# EAGLE design Digispark_clone (EAGLE 6.5.0)
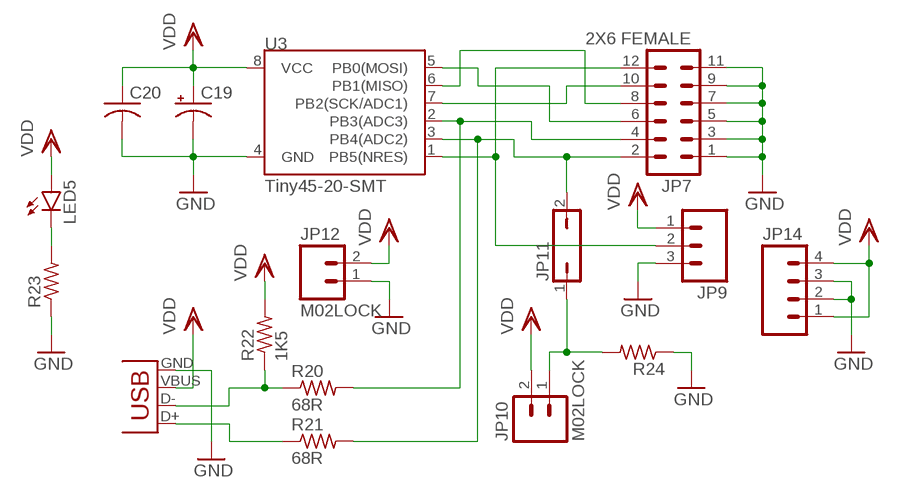
[diagram p0: schematic, sheet 1]

## Parts
C19  CPOL-USE2-5  [E2-5]
C20  C-USC0805  [C0805]
JP7  2X6 FEMALE  M06X2PTH_FEMALE  [2X6]
JP8  USB-SMD-NS  [USB-MINIB-NOSTOP]
JP9  M03LOCK  [1X03_LOCK]
JP10  M02LOCK  [1X02_LOCK]
JP11  JP1Q  [JP1]
JP12  M02LOCK  [1X02_LOCK]
JP14  M04LOCK  [1X04_LOCK]
LED5  LED1206  [LED-1206]
R20  68R  R-US_R0805  [R0805]
R21  68R  R-US_R0805  [R0805]
R22  1K5  R-US_R0805  [R0805]
R23  R-US_R0805  [R0805]
R24  R-US_R0805  [R0805]
U3  Tiny45-20-SMT  ATTINY45TINY45-20-SMT  [SO08-EIAJ]

## Nets
D+: JP7.2 JP11.2 R21.2 U3.3(PB4(ADC2))
D-: JP7.4 R20.2 U3.2(PB3(ADC3))
GND: C19.- C20.2 JP7.1 JP7.3 JP7.5 JP7.7 JP7.9 JP7.11 JP8.GND JP9.3 JP12.1 JP14.2 JP14.3 R23.1 R24.1 U3.4(GND)
N$27: JP7.12 JP9.2 U3.1(PB5(NRES))
N$28: JP7.6 U3.5(PB0(MOSI))
N$29: JP7.10 U3.7(PB2(SCK/ADC1))
N$30: JP10.1 JP11.1 R24.2
N$32: JP7.8 U3.6(PB1(MISO))
N$33: LED5.C R23.2
N$34: JP8.D- R20.1 R22.1
N$35: JP8.D+ R21.1
VDD: C19.+ C20.1 JP8.VBUS JP9.1 JP10.2 JP12.2 JP14.1 JP14.4 LED5.A R22.2 U3.8(VCC)

## Library data of the parts
C19 = rcl:CPOL-US: POLARIZED CAPACITOR, American symbol
C20 = rcl:C-US: CAPACITOR, American symbol
JP7 = SparkFun-Connectors:M06X2; PROD_ID: CONN-12423
JP8 = SparkFun-Connectors:USB: USB Connectors USB-B-PTH is fully proven SKU : PRT-00139/CONN-08278 USB-miniB is fully proven SKU : PRT-00587 USB-A-PCB is untested. USB-A-H is throughly reviewed, but untested. Spark Fun Electronics SKU : PRT-00437 USB-B-SMT is throughly reviewed, but untested. Needs silkscreen touching up. USB-A-S has not been used/tested USB-MB-H has not been used/tested USB-MICROB has been used. CONN-09505
JP9 = SparkFun-Connectors:M03: Header 3 Standard 3-pin 0.1" header. Use with straight break away headers (SKU : PRT-00116), right angle break away headers (PRT-00553), swiss pins (PRT-00743), machine pins (PRT-00117), and female headers (PRT-00115). Molex polarized connector foot print use with SKU : PRT-08232 with associated crimp pins and housings.
JP10 JP12 = SparkFun-Connectors:M02: Standard 2-pin 0.1" header. Use with - straight break away headers ( PRT-00116) - right angle break away headers (PRT-00553) - swiss pins (PRT-00743) - machine pins (PRT-00117) - female headers (PRT-00115) Molex polarized connector foot print use with: PRT-08233 with associated crimp pins and housings. 2.54_SCREWTERM for use with PRT-10571. 3.5mm Screw Terminal footprints for PRT-08084 5mm Screw Terminal footprints for use with PRT-08432
JP11 = jumper:JP1Q: JUMPER
JP14 = SparkFun-Connectors:M04: Header 4 Standard 4-pin 0.1" header. Use with straight break away headers (SKU : PRT-00116), right angle break away headers (PRT-00553), swiss pins (PRT-00743), machine pins (PRT-00117), and female headers (PRT-00115). Molex polarized connector foot print use with SKU : PRT-08231 with associated crimp pins and housings. 1MM SMD Version SKU: PRT-10208
LED5 = SparkFun-LED:LED: LEDs Standard schematic elements and footprints for 5mm, 3mm, 1206, and 0603 sized LEDs. 5mm - Spark Fun Electronics SKU : COM-00529 (and others)
R20-R24 = rcl:R-US_: RESISTOR, American symbol
U3 = SparkFun-DigitalIC:ATTINY45: Atmel 8-pin 2/4/8kB flash uC; PROD_ID: IC-08922

## Board
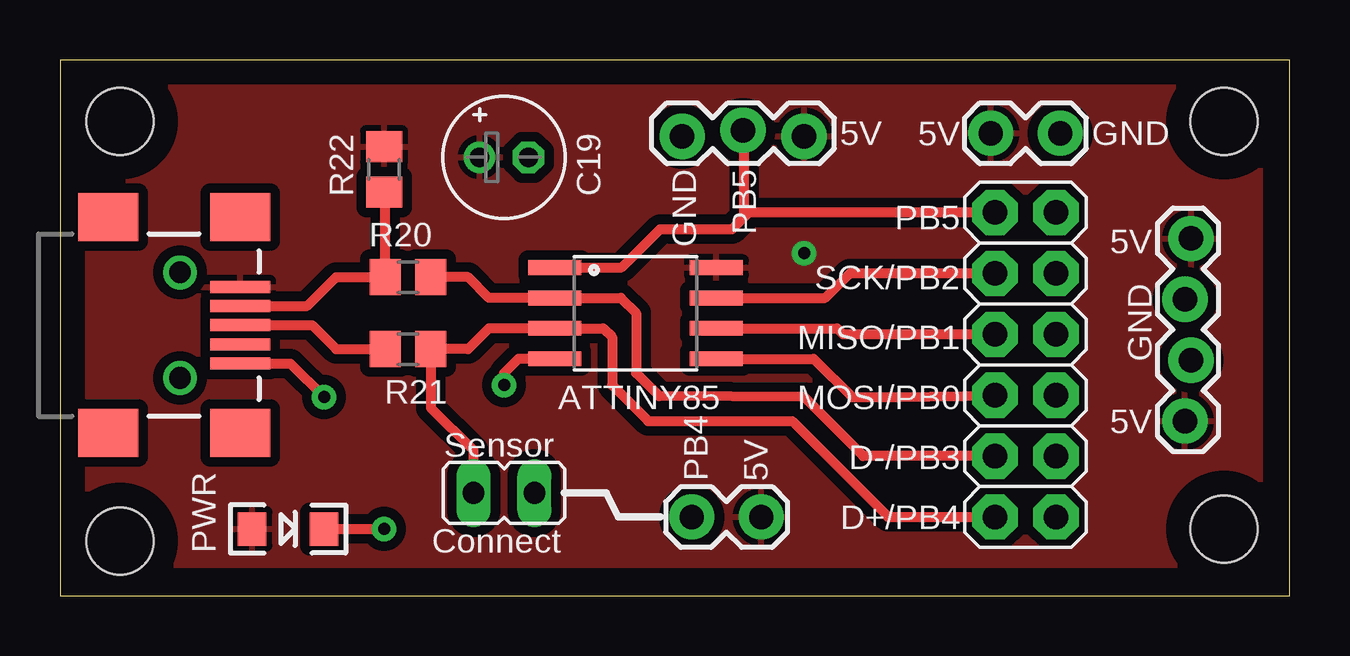
[diagram p1: board, top side]
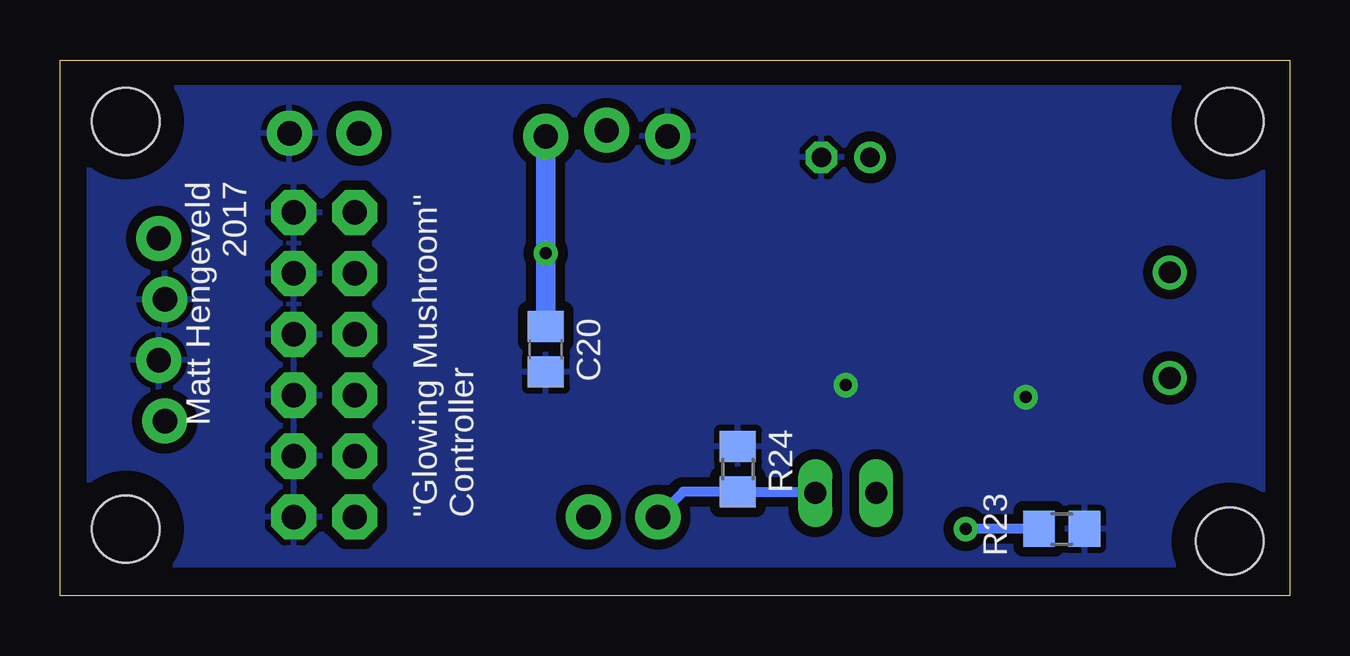
[diagram p2: board, bottom side, seen from below]

Size 51.24 x 22.34 mm. Coordinates in mm from the lower left corner, seen from the top.
Outline: 0,0 51.24,0 51.24,22.34 0,22.34 0,0
Copper layers (1*16): Top 0.035mm / dielectric 1.5mm / Bottom 0.035mm
Design rules "default": minimum track width 10mil, minimum drill 24mil, track to track 8mil, track to pad 8mil, pad to pad 8mil, via to via 8mil, smd to smd 8mil, copper to edge 40mil, drill to drill 8mil, minimum pad ring 10mil, minimum via ring 8mil, stop-mask expansion 4mil, vias tented up to drill 0mil, thermal gap 10mil
Holes 2.8 mm at 48.5,2.78 2.5,19.78 2.5,2.28 48.5,19.78

### Footprints (pad centres in the part's own frame; a part is rotated, then mirrored left to right if it is on the bottom)
E2-5 = drill 0.813 pad 1.27: + -1.016,0 | drill 0.813 pad 1.27 octagon: - 1.016,0
C0805 = smd 1.3 x 1.5: 1 -0.95,0; 2 0.95,0
2X6 = drill 1.016 pad 1.88 octagon: 1 0,0; 2 0,2.54; 3 2.54,0; 4 2.54,2.54; 5 5.08,0; 6 5.08,2.54; 7 7.62,0; 8 7.62,2.54; 9 10.16,0; 10 10.16,2.54; 11 12.7,0; 12 12.7,2.54
USB-MINIB-NOSTOP = smd 2.5 x 0.5: D+ 2.5,0; D- 2.5,0.8; GND 2.5,-1.6; ID 2.5,-0.8; VBUS 2.5,1.6 | smd 2.5 x 2: G1 -3,-4.5; G2 -3,4.5; G3 2.5,4.5; G4 2.5,-4.5 | drill 0.9 pad 0.8: H1 0,2.2 | drill 0.9 pad 0.787: H2 0,-2.2
1X03_LOCK = drill 1.016 pad 1.88: 1 0,0.127; 2 2.54,-0.127; 3 5.08,0.127
1X02_LOCK = drill 1.016 pad 1.88: 1 -0.178,0; 2 2.718,0
JP1 = drill 0.914 long: 1 0,-1.27; 2 0,1.27
1X04_LOCK = drill 1.016 pad 1.88: 1 0,0.127; 2 2.54,-0.127; 3 5.08,0.127; 4 7.62,-0.127
LED-1206 = smd 1.2 x 1.4: A -1.5,0; C 1.5,0
R0805 = smd 1.3 x 1.5: 1 -0.95,0; 2 0.95,0
SO08-EIAJ = smd 0.61 x 2.21: 1 -1.905,-3.378; 2 -0.635,-3.378; 3 0.635,-3.378; 4 1.905,-3.378; 5 1.905,3.353; 6 0.635,3.353; 7 -0.635,3.353; 8 -1.905,3.353

### Placement (x,y rotation side)
C19  18.5,18.28 0 top
C20  31,10.28 270 bottom
JP7  41.5,3.28 90 top
JP8  5,11.28 0 top
JP9  31,19.28 180 top
JP10  26.5,3.28 0 top
JP11  18.5,4.28 90 top
JP12  41.5,19.28 180 top
JP14  47,7.28 90 top
LED5  9.5,2.78 0 top
R20  14.5,13.28 0 top
R21  14.5,10.28 0 top
R22  13.5,17.78 90 top
R23  9.5,2.78 180 bottom
R24  23,5.28 270 bottom
U3  24,11.78 270 top

### Tracks (layer width: path | path; a pad name or v marks a point on that pad's centre or on a via)
D+
  Top 0.406: JP7.2 34.5,3.28 30.5,7.28 24.5,7.28 23,8.78 23,10.78 22.64,11.15 U3.3 17.86,11.15 17,10.28 R21.2 15.45,7.83 17.23,6.05 JP11.2
D-
  Top 0.406: R20.2 17,13.28 17.86,12.42 U3.2 23.36,12.42 24,11.78 24,9.28 24.96,8.32 31,8.28 33.46,5.82 JP7.4
GND  (via drill 0.5 pad 1.02)
  Top 0.406: JP8.GND 9.6,9.68 v11,8.28 | U3.4 19.09,9.88 18.5,9.28 v18.5,8.78
  pour Bottom (isolate 0.406): 48,21.28 3,21.28 1,19.28 1,3.28 3,1.28 48,1.28 50,3.28 50,19.28
N$27
  Top 0.406: U3.1 23.41,13.69 25,15.28 28,15.28 28.5,15.78 | 28.5,15.78 28.5,18.37 JP9.2 | JP7.12 28.7,15.98 28.5,15.78
N$28
  Top 0.406: U3.5 31.41,9.88 33,8.28 34.88,8.28 JP7.6
N$29
  Top 0.406: U3.7 31.89,12.42 32.91,13.44 JP7.10
N$30
  Bottom 0.406: JP10.1 25.27,4.33 R24.2 19.82,4.33 JP11.1
N$32
  Top 0.406: JP7.8 32.63,10.9 32.38,11.15 U3.6
N$33  (via drill 0.5 pad 1.02)
  Top 0.406: LED5.C v13.5,2.78
  Bottom 0.406: R23.2 v13.5,2.78
N$34
  Top 0.406: JP8.D- 10.3,12.08 11.5,13.28 R20.1 13.55,16.78 R22.1
N$35
  Top 0.406: JP8.D+ 10.5,11.28 11.5,10.28 R21.1
VDD  (via drill 0.5 pad 1.02)
  Bottom 0.813: C20.1 v31,14.28 JP9.1
  pour Top (isolate 0.406): 48,21.28 3,21.28 1,19.28 1,3.28 3,1.28 48,1.28 50,3.28 50,19.28

### Text on the board
tPlace: 5V | 5V | GND | GND | PB5 | PB5 | 5V | SCK/PB2 | MISO/PB1 | GND | ATTINY85 | MOSI/PB0 | 5V | Sensor | D-/PB3 | PB4 | 5V | D+/PB4 | PWR | Connect
bPlace: Matt Hengeveld / 2017 | "Glowing Mushroom" / Controller